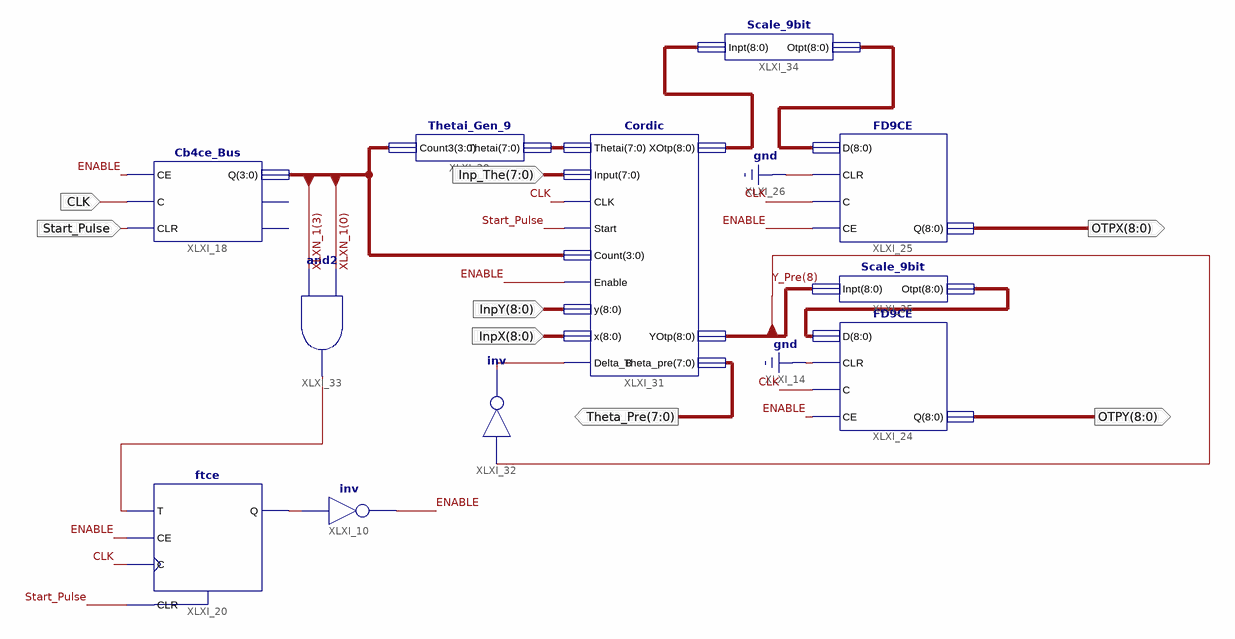
[diagram p0: schematic sheet 1]
// Xilinx ISE schematic Main.sch (spartan3e) as structural Verilog: 11 symbols, 8 ports
module Main (
  input  CLK,
  input  [7:0] Inp_The,
  input  [8:0] InpY,
  input  [8:0] InpX,
  input  Start_Pulse,
  output [8:0] OTPX,
  output [8:0] OTPY,
  output [7:0] Theta_Pre
);

  wire ENABLE, XLXN_15, XLXN_56, XLXN_95;
  wire [3:0] XLXN_1;
  wire [7:0] XLXN_3;
  wire [8:0] XLXN_96, XLXN_97, XLXN_98, Y_Pre;

  not XLXI_10 (ENABLE, XLXN_15);
  Cb4ce_Bus XLXI_18 (.CE(ENABLE), .C(CLK), .CLR(Start_Pulse), .Q(XLXN_1));  // open: CEO, TC
  ftce XLXI_20 (.C(CLK), .CE(ENABLE), .CLR(Start_Pulse), .T(XLXN_56), .Q(XLXN_15));
  FD9CE XLXI_24 (.CE(ENABLE), .C(CLK), .CLR(1'b0), .D(XLXN_96), .Q(OTPY));
  FD9CE XLXI_25 (.CE(ENABLE), .C(CLK), .CLR(1'b0), .D(XLXN_98), .Q(OTPX));
  Thetai_Gen_9 XLXI_30 (.Count3(XLXN_1), .Thetai(XLXN_3));
  Cordic XLXI_31 (
    .Thetai(XLXN_3), .Input(Inp_The), .CLK(CLK), .Start(Start_Pulse), .Count(XLXN_1), .Enable(ENABLE),
    .y(InpY), .x(InpX), .Delta_B(XLXN_95), .XOtp(XLXN_97), .YOtp(Y_Pre), .Theta_pre(Theta_Pre));
  not XLXI_32 (XLXN_95, Y_Pre[8]);
  and XLXI_33 (XLXN_56, XLXN_1[3], XLXN_1[0]);
  Scale_9bit XLXI_34 (.Inpt(XLXN_97), .Otpt(XLXN_98));
  Scale_9bit XLXI_35 (.Inpt(Y_Pre), .Otpt(XLXN_96));
endmodule
